# Altium schematic sheet STM32F030F4P6.SchDoc
size A4
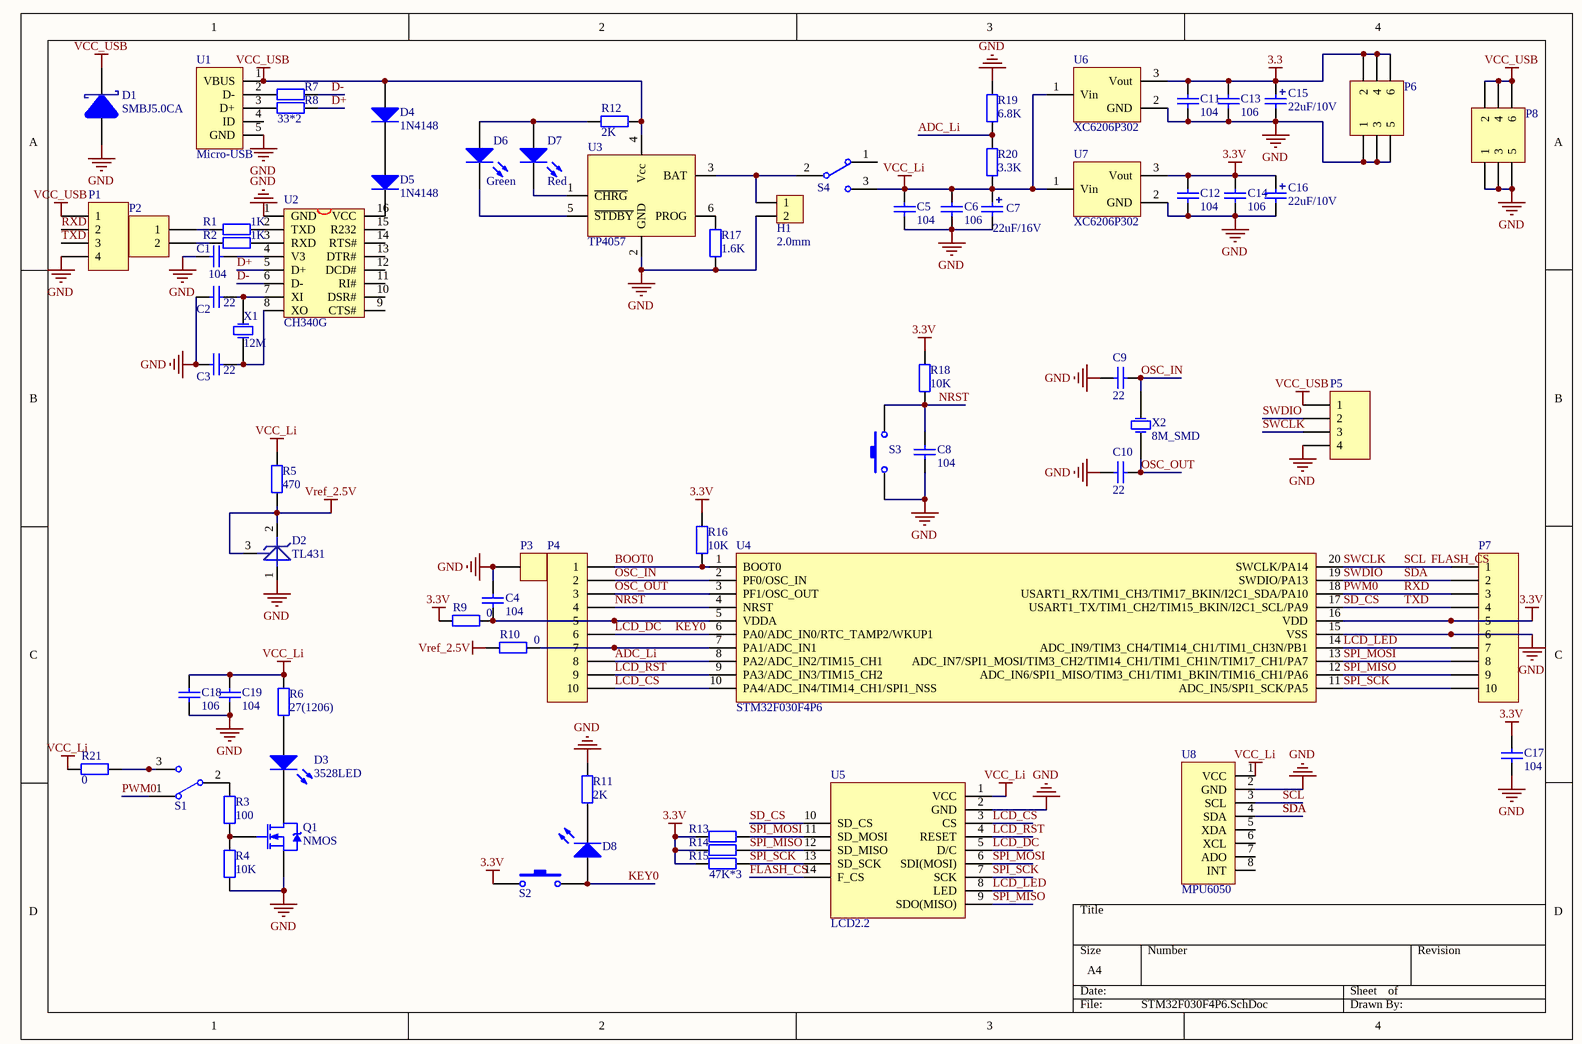
[diagram p0: STM32F030F4P6.SchDoc]

## Parts
C1  value 104  [0603]  (hidden comment: Cap1)
C2  value 22  [0603]  (hidden comment: Cap1)
C3  value 22  [0603]  (hidden comment: Cap1)
C4  value 104  [0603]  (hidden comment: Cap1)
C5  value 104  [0603]  (hidden comment: Cap1)
C6  value 106  [0603]  (hidden comment: Cap1)
C7  value 22uF/16V  [3528(22u16V钽电容)]  (hidden comment: Cap_Pol)
C8  value 104  [0603]  (hidden comment: Cap1)
C9  value 22  [0603]  (hidden comment: Cap1)
C10  value 22  [0603]  (hidden comment: Cap1)
C11  value 104  [0603]  (hidden comment: Cap1)
C12  value 104  [0603]  (hidden comment: Cap1)
C13  value 106  [0603]  (hidden comment: Cap1)
C14  value 106  [0603]  (hidden comment: Cap1)
C15  value 22uF/10V  [3216[1206]]  (hidden comment: Cap_Pol)
C16  value 22uF/10V  [3216[1206]]  (hidden comment: Cap_Pol)
C17  value 104  [0603]  (hidden comment: Cap1)
C18  value 106  [0603]  (hidden comment: Cap1)
C19  value 104  [0603]  (hidden comment: Cap1)
D1  SMBJ5.0CA  [TVS]
D2  TL431  [SOT-23]
D3  3528LED  [3528(22u16V钽电容)]
D4  1N4148  [1N4148]
D5  1N4148  [1N4148]
D6  Green  [0603-Polar]
D7  Red  [0603-Polar]
D8  LED1  [0603-Polar]  (value not drawn)
H1  2.0mm  [H2-防反 2.0]
P1  Header 4  [HDR1X4]  (value not drawn)
P2  Header 2  [HDR1X2]  (value not drawn)
P3  TEST  [HDR1X1]  (value not drawn)
P4  Header 10  [HDR1X10]  (value not drawn)
P5  Header 4  [HDR1X4]  (value not drawn)
P6  Header 3X2  [HDR2X3]  (value not drawn)
P7  Header 10  [HDR1X10]  (value not drawn)
P8  Header 3X2  [HDR2X3]  (value not drawn)
Q1  NMOS  [SOT-23-3 - AO3400]
R1  value 1K  [0603]  (hidden comment: Res1)
R2  value 1K  [0603]  (hidden comment: Res1)
R3  value 100  [0603]  (hidden comment: Res1)
R4  value 10K  [0603]  (hidden comment: Res1)
R5  value 470  [0603]  (hidden comment: Res1)
R6  value 27(1206)  [3216[1206]]  (hidden comment: Res1)
R7  Res1  [0603]  (value not drawn)
R8  value 33*2  [0603]  (hidden comment: Res1)
R9  value 0  [0603]  (hidden comment: Res1)
R10  value 0  [0603]  (hidden comment: Res1)
R11  value 2K  [0603]  (hidden comment: Res1)
R12  value 2K  [0603]  (hidden comment: Res1)
R13  Res1  [0603]  (value not drawn)
R14  Res1  [0603]  (value not drawn)
R15  value 47K*3  [0603]  (hidden comment: Res1)
R16  value 10K  [0603]  (hidden comment: Res1)
R17  value 1.6K  [0603]  (hidden comment: Res1)
R18  value 10K  [0603]  (hidden comment: Res1)
R19  value 6.8K  [0603]  (hidden comment: Res1)
R20  value 3.3K  [0603]  (hidden comment: Res1)
R21  value 0  [0603]  (hidden comment: Res1)
S1  SW3  [SW-3]  (value not drawn)
S2  SW-PB_1  [SW-2]  (value not drawn)
S3  SW-PB_1  [SW-2]  (value not drawn)
S4  SW3  [SW-3]  (value not drawn)
U1  Micro-USB  [MICRO-USB-F]
U2  CH340G  [SOP16M]
U3  TP4057  [SOT-23-6]
U4  STM32F030F4P6  [TSSOP20]
U5  LCD2.2  [LCD2.2 _2]
U6  XC6206P302  [SOT-23]
U7  XC6206P302  [SOT-23]
U8  MPU6050  [HDR1X8]
X1  12M  [XTAL_SMD]
X2  8M_SMD  [XTAL_SMD]

## Nets
3.3: C11.2 C13.2 C15.1 P6.2 P6.4 P6.6 U6.3(Vout)
3.3V: C12.2 C14.2 C16.1 C17.2 P7.5 R9.1 R13.2 R14.2 R15.2 R16.2 R18.2 S2.1 U4.16(VDD) U7.3(Vout)
GND: C1.1 C2.1 C3.1 C4.2 C5.1 C6.1 C7.2 C8.1 C9.1 C10.1 C11.1 C12.1 C13.1 C14.1 C15.2 C16.2 C17.1 C18.1 C19.1 D1.1 D2.1 H1.2 P1.4 P3.1 P5.4 P6.1 P6.3 P6.5 P7.6 P8.1 P8.3 P8.5 Q1.3(S) R4.1 R11.2 R17.1 R19.2 S3.1 U1.5(GND) U2.1(GND) U3.2(GND) U4.15(VSS) U5.2(GND) U6.2(GND) U7.2(GND) U8.2(GND)
VCC_Li: C5.2 C6.2 C7.1 C18.2 C19.2 R5.2 R6.2 R20.1 R21.1 S4.3 U5.1(VCC) U6.1(Vin) U7.1(Vin) U8.1(VCC)
VCC_USB: D1.2 D4.1(A) P1.1 P5.1 P8.2 P8.4 P8.6 R12.1 U1.1(VBUS) U3.4(Vcc)
Vref_2.5V: D2.2 D2.3 R5.1 R10.1
ADC_Li: P4.8 R19.1 R20.2 U4.8(PA2/ADC_IN2/TIM15_CH1)
BOOT0: P4.1 R16.1 U4.1(BOOT0)
D+: R8.2 U2.5(D+)
D-: R7.2 U2.6(D-)
FLASH_CS: P5.3 P7.1 U4.20(SWCLK/PA14) U5.14(F_CS) U8.3(SCL)  [also labelled SCL, SWCLK]
KEY0: D8.1(A) P4.6 S2.2 U4.6(PA0/ADC_IN0/RTC_TAMP2/WKUP1) U5.5(D/C)  [also labelled LCD_DC]
LCD_CS: P4.10 U4.10(PA4/ADC_IN4/TIM14_CH1/SPI1_NSS) U5.3(CS)
LCD_LED: P7.7 U4.14(ADC_IN9/TIM3_CH4/TIM14_CH1/TIM1_CH3N/PB1) U5.8(LED)
LCD_RST: P4.9 U4.9(PA3/ADC_IN3/TIM15_CH2) U5.4(RESET)
NRST: C8.2 P4.4 R18.1 S3.2 U4.4(NRST)
OSC_IN: C9.2 P4.2 U4.2(PF0/OSC_IN) X2.2(OSC2)
OSC_OUT: C10.2 P4.3 U4.3(PF1/OSC_OUT) X2.1(OSC1)
PWM0: P1.2 P7.3 S1.1 U4.18(USART1_RX/TIM1_CH3/TIM17_BKIN/I2C1_SDA/PA10)  [also labelled RXD]
SD_CS: P1.3 P7.4 U4.17(USART1_TX/TIM1_CH2/TIM15_BKIN/I2C1_SCL/PA9) U5.10(SD_CS)  [also labelled TXD]
SDA: P5.2 P7.2 U4.19(SWDIO/PA13) U8.4(SDA)  [also labelled SWDIO]
SPI_MISO: P7.9 R14.1 U4.12(ADC_IN6/SPI1_MISO/TIM3_CH1/TIM1_BKIN/TIM16_CH1/PA6) U5.9(SDO(MISO)) U5.12(SD_MISO)
SPI_MOSI: P7.8 R13.1 U4.13(ADC_IN7/SPI1_MOSI/TIM3_CH2/TIM14_CH1/TIM1_CH1N/TIM17_CH1/PA7) U5.6(SDI(MOSI)) U5.11(SD_MOSI)
SPI_SCK: P7.10 R15.1 U4.11(ADC_IN5/SPI1_SCK/PA5) U5.7(SCK) U5.13(SD_SCK)
NetC1_2: C1.2 U2.4(V3)
NetC2_2: C2.2 U2.7(XI) X1.2(OSC2)
NetC3_2: C3.2 U2.8(XO) X1.1(OSC1)
NetC4_1: C4.1 P4.5 R9.2 U4.5(VDDA)
NetD3_1: D3.1(A) R6.1
NetD3_2: D3.2(K) Q1.2(D)
NetD4_2: D4.2(K) D5.1(A)
NetD5_2: D5.2(K) U2.16(VCC)
NetD6_1: D6.1(A) D7.1(A) R12.2
NetD6_2: D6.2(K) U3.5(~{STDBY})
NetD7_2: D7.2(K) U3.1(~{CHRG})
NetD8_2: D8.2(K) R11.1
NetH1_1: H1.1 S4.2 U3.3(BAT)
NetP2_1: P2.1 R1.1
NetP2_2: P2.2 R2.1
NetP4_7: P4.7 R10.2 U4.7(PA1/ADC_IN1)
NetQ1_1: Q1.1(G) R3.1 R4.2
NetR1_2: R1.2 U2.2(TXD)
NetR2_2: R2.2 U2.3(RXD)
NetR3_2: R3.2 S1.2
NetR7_1: R7.1 U1.2(D-)
NetR8_1: R8.1 U1.3(D+)
NetR17_2: R17.2 U3.6(PROG)
NetR21_2: R21.2 S1.3

Not connected (* = marked no-connect by the designer): S4 1; U1 4(ID); U2 9(CTS#) 10(DSR#) 11(RI#) 12(DCD#) 13(DTR#) 14(RTS#) 15(R232); U8 5(XDA) 6(XCL) 7(ADO) 8(INT)

## Library data of the parts
C1-C6 C8-C14 C17-C19 = Cap1: Capacitor; Published: 8-Jun-2000; LatestRevisionDate: 17-Jul-2002; LatestRevisionNote: Re-released for DXP Platform.; PackageReference: RAD-0.3; Publisher: Altium Limited
C7 C15 C16 = Cap_Pol: Capacitor; Published: 8-Jun-2000; LatestRevisionDate: 17-Jul-2002; LatestRevisionNote: Re-released for DXP Platform.; PackageReference: RAD-0.3; Publisher: Altium Limited
D1 = TVS
D2 = TL431-SOT23
D3 D6-D8 = LED1: Typical INFRARED GaAs LED; Published: 8-Jun-2000; LatestRevisionDate: 08-Jul-2005; LatestRevisionNote: Mech Layer 1 removed.; PackageReference: LED-0; Publisher: Altium Limited
D4 D5 = 1N4148: Default Diode; Published: 8-Jun-2000; LatestRevisionDate: 17-Jul-2002; LatestRevisionNote: Re-released for DXP Platform.; PackageDocument: Sep-1996; PackageReference: SMC; Publisher: Altium Limited; Code_JEDEC: DO-214-AB
H1 = H2-防反
P1 P5 = Header 4: Header, 4-Pin; LatestRevisionDate: 17-Jul-2002; LatestRevisionNote: Re-released for DXP Platform.; Publisher: Altium Limited
P2 = Header 2: Header, 2-Pin; LatestRevisionDate: 17-Jul-2002; LatestRevisionNote: Re-released for DXP Platform.; Publisher: Altium Limited
P4 P7 = Header 10: Header, 10-Pin; LatestRevisionDate: 17-Jul-2002; LatestRevisionNote: Re-released for DXP Platform.; Publisher: Altium Limited
P6 P8 = Header 3X2: Header, 3-Pin, Dual row; LatestRevisionDate: 17-Jul-2002; LatestRevisionNote: Re-released for DXP Platform.; Publisher: Altium Limited
Q1 = NMOS: N-Channel Power MOSFET; Note: Pin 2 is electrically connected to pin 4.; Published: 8-Jun-2000; LatestRevisionDate: 17-Jul-2002; LatestRevisionNote: Re-released for DXP Platform.; DatasheetDocument: PD-9.814; PackageReference: TO-220AB; Publisher: Altium Limited; Code_JEDEC: TO-220-AB; ComponentLink1Description: Manufacturer Link; ComponentLink1URL: http://www.irf.com/
R1-R6 R8-R12 R15-R21 = Res1: Resistor; Published: 8-Jun-2000; LatestRevisionDate: 17-Jul-2002; LatestRevisionNote: Re-released for DXP Platform.; PackageReference: AXIAL-0.4; Publisher: Altium Limited
R7 = Res1: Resistor; Value: 33; Published: 8-Jun-2000; LatestRevisionDate: 17-Jul-2002; LatestRevisionNote: Re-released for DXP Platform.; PackageReference: AXIAL-0.4; Publisher: Altium Limited
R13 R14 = Res1: Resistor; Value: 47K; Published: 8-Jun-2000; LatestRevisionDate: 17-Jul-2002; LatestRevisionNote: Re-released for DXP Platform.; PackageReference: AXIAL-0.4; Publisher: Altium Limited
S1 S4 = SW3: Switch; Published: 24-Mar-1999; LatestRevisionDate: 17-Jul-2002; LatestRevisionNote: Re-released for DXP Platform.; PackageReference: SOT23-6; Publisher: Altium Limited
S2 S3 = SW-PB_1: Switch; Published: 24-Mar-1999; LatestRevisionDate: 17-Jul-2002; LatestRevisionNote: Re-released for DXP Platform.; PackageReference: SPST-2; Publisher: Altium Limited
U2 = CH340G: USB2UART
U6 U7 = 662k
U8 = MPU6050_1
X1 X2 = XTAL_1: Crystal Oscillator; Published: 8-Jun-2000; LatestRevisionDate: 17-Jul-2002; LatestRevisionNote: Re-released for DXP Platform.; PackageReference: R38; Publisher: Altium Limited